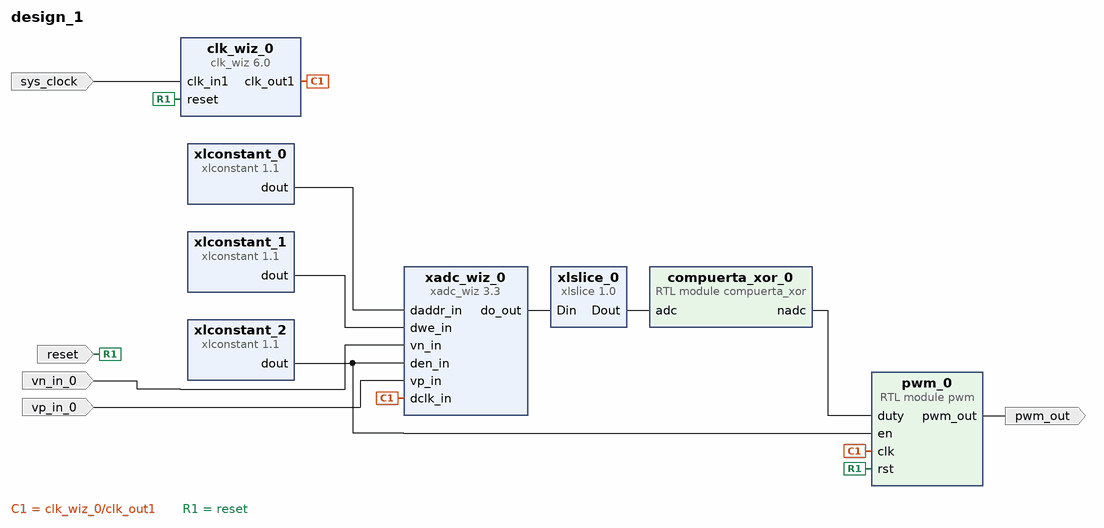
[diagram p0: block diagram of the top level]
# Vivado block design design_1, xc7z007sclg400-1, Vivado 2019.1
create_bd_design design_1

create_bd_port -dir I sys_clock
create_bd_port -dir I reset
create_bd_port -dir I vn_in_0
create_bd_port -dir I vp_in_0
create_bd_port -dir O pwm_out

create_bd_cell -type ip -vlnv xilinx.com:ip:xadc_wiz:3.3 xadc_wiz_0
set_property -dict [list \
  CONFIG.ADC_CONVERSION_RATE 45 \
  CONFIG.BIPOLAR_OPERATION true \
  CONFIG.ENABLE_RESET true \
  CONFIG.ENABLE_VCCDDRO_ALARM false \
  CONFIG.ENABLE_VCCPAUX_ALARM false \
  CONFIG.ENABLE_VCCPINT_ALARM false \
  CONFIG.INTERFACE_SELECTION ENABLE_DRP \
  CONFIG.OT_ALARM false \
  CONFIG.SINGLE_CHANNEL_SELECTION VP_VN \
  CONFIG.USER_TEMP_ALARM false \
  CONFIG.VCCAUX_ALARM false \
  CONFIG.VCCINT_ALARM false \
] [get_bd_cells xadc_wiz_0]
create_bd_cell -type ip -vlnv xilinx.com:ip:xlconstant:1.1 xlconstant_0
set_property -dict {CONFIG.CONST_VAL 3 CONFIG.CONST_WIDTH 7} [get_bd_cells xlconstant_0]
create_bd_cell -type ip -vlnv xilinx.com:ip:xlconstant:1.1 xlconstant_1
set_property -dict {CONFIG.CONST_VAL 0} [get_bd_cells xlconstant_1]
create_bd_cell -type ip -vlnv xilinx.com:ip:xlconstant:1.1 xlconstant_2
create_bd_cell -type ip -vlnv xilinx.com:ip:clk_wiz:6.0 clk_wiz_0
set_property -dict [list \
  CONFIG.CLKIN1_JITTER_PS 80.0 \
  CONFIG.CLKOUT1_JITTER 124.615 \
  CONFIG.CLKOUT1_PHASE_ERROR 96.948 \
  CONFIG.CLK_IN1_BOARD_INTERFACE sys_clock \
  CONFIG.MMCM_CLKFBOUT_MULT_F 8.000 \
  CONFIG.MMCM_CLKIN1_PERIOD 8.000 \
  CONFIG.USE_LOCKED false \
] [get_bd_cells clk_wiz_0]
create_bd_cell -type module -reference compuerta_xor compuerta_xor_0
create_bd_cell -type module -reference pwm pwm_0
create_bd_cell -type ip -vlnv xilinx.com:ip:xlslice:1.0 xlslice_0
set_property -dict {CONFIG.DIN_FROM 15 CONFIG.DIN_TO 8 CONFIG.DIN_WIDTH 16 CONFIG.DOUT_WIDTH 8} [get_bd_cells xlslice_0]

# ---- connections ----

connect_bd_net [get_bd_pins xlconstant_0/dout] [get_bd_pins xadc_wiz_0/daddr_in]
connect_bd_net [get_bd_pins xlconstant_1/dout] [get_bd_pins xadc_wiz_0/dwe_in]
connect_bd_net [get_bd_pins xlconstant_2/dout] [get_bd_pins xadc_wiz_0/den_in] [get_bd_pins pwm_0/en]
connect_bd_net [get_bd_pins clk_wiz_0/clk_out1] [get_bd_pins xadc_wiz_0/dclk_in] [get_bd_pins pwm_0/clk]
connect_bd_net [get_bd_ports reset] [get_bd_pins pwm_0/rst] [get_bd_pins clk_wiz_0/reset]
connect_bd_net [get_bd_pins compuerta_xor_0/nadc] [get_bd_pins pwm_0/duty]
connect_bd_net [get_bd_pins xlslice_0/Dout] [get_bd_pins compuerta_xor_0/adc]
connect_bd_net [get_bd_pins xadc_wiz_0/do_out] [get_bd_pins xlslice_0/Din]
connect_bd_net [get_bd_ports sys_clock] [get_bd_pins clk_wiz_0/clk_in1]
connect_bd_net -net vn_in_0_1 [get_bd_ports vn_in_0] [get_bd_pins xadc_wiz_0/vn_in]
connect_bd_net -net vp_in_0_1 [get_bd_ports vp_in_0] [get_bd_pins xadc_wiz_0/vp_in]
connect_bd_net [get_bd_pins pwm_0/pwm_out] [get_bd_ports pwm_out]

validate_bd_design
save_bd_design
